# EAGLE design pr0board_main (EAGLE 9.6.2)
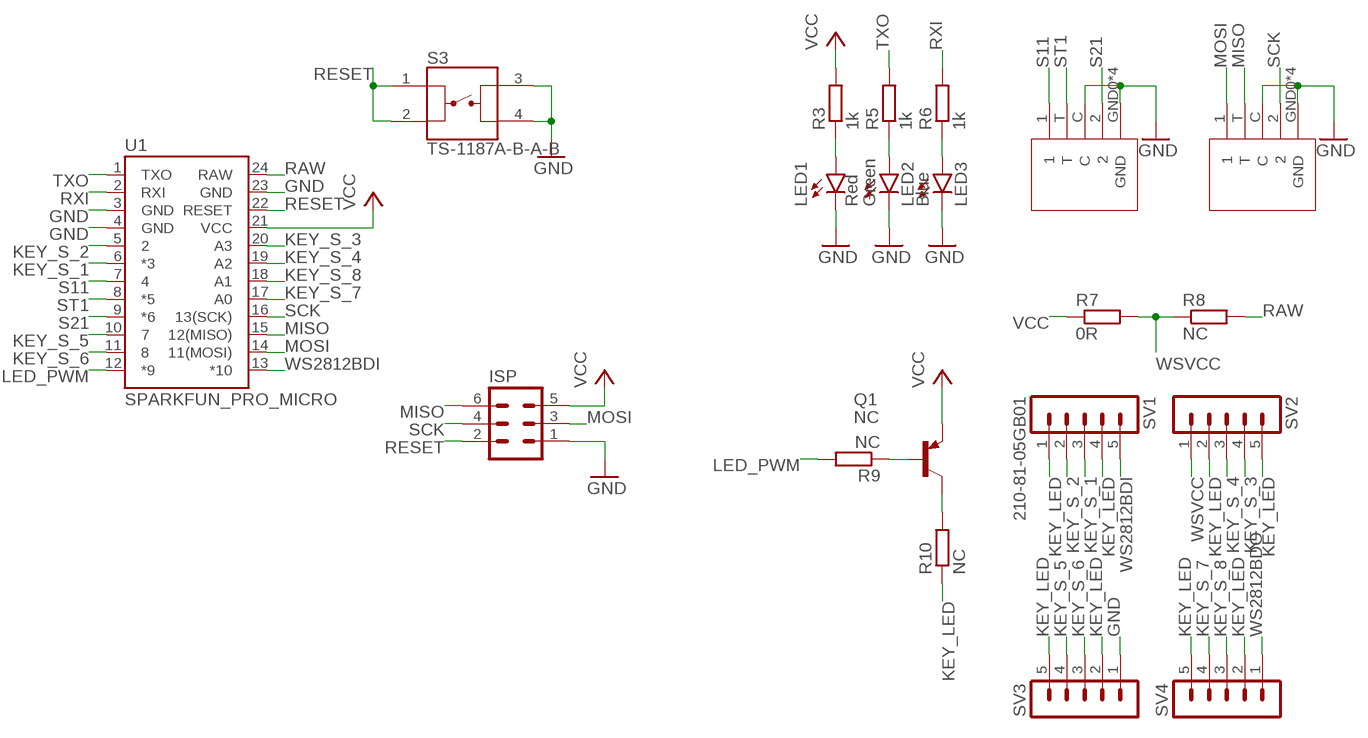
[diagram p0: schematic, sheet 1]

## Parts
ISP  MA03-2  [MA03-2]
LED1  Red  LEDCHIP-LED0603  [CHIP-LED0603]
LED2  Green  LEDCHIP-LED0603  [CHIP-LED0603]
LED3  Blue  LEDCHIP-LED0603  [CHIP-LED0603]
Q1  NC  MMBTA56-SOT23  [SOT23]
R3  1k  R-EU_R0603  [R0603]
R5  1k  R-EU_R0603  [R0603]
R6  1k  R-EU_R0603  [R0603]
R7  0R  R-EU_R0603  [R0603]
R8  NC  R-EU_R0603  [R0603]
R9  NC  R-EU_R0603  [R0603]
R10  NC  R-EU_R0805  [R0805]
S1  TM-2024A  [TM-2024A]
S2  TM-2024A  [TM-2024A]
S3  TS-1187A-B-A-B  PTS525SM15SMTR2LFS  [SW_PTS525SM15SMTR2LFS]
SV1  210-81-05GB01  MA05-1  [MA05-1]
SV2  MA05-1  [MA05-1]
SV3  MA05-1  [MA05-1]
SV4  MA05-1  [MA05-1]
U1  SPARKFUN_PRO_MICRO  [SPARKFUN_PRO_MICRO]

## Nets
GND: ISP.1 LED1.C LED2.C LED3.C S1.C S1.GND0(GND) S1.GND1(GND) S1.GND2(GND) S1.GND3(GND) S2.C S2.GND0(GND) S2.GND1(GND) S2.GND2(GND) S2.GND3(GND) S3.3 S3.4 SV3.1 U1.3(GND) U1.4(GND) U1.23(GND)
KEY_LED: R10.1 SV1.1 SV1.4 SV2.2 SV2.5 SV3.2 SV3.5 SV4.2 SV4.5
KEY_S_1: SV1.3 U1.6(*3)
KEY_S_2: SV1.2 U1.5
KEY_S_3: SV2.4 U1.20(A3)
KEY_S_4: SV2.3 U1.19(A2)
KEY_S_5: SV3.4 U1.10
KEY_S_6: SV3.3 U1.11
KEY_S_7: SV4.4 U1.17(A0)
KEY_S_8: SV4.3 U1.18(A1)
LED_PWM: R9.2 U1.12(*9)
MISO: ISP.6 S2.T U1.15(12(MISO))
MOSI: ISP.3 S2.1 U1.14(11(MOSI))
N$1: LED2.A R5.1
N$2: LED3.A R6.1
N$3: LED1.A R3.1
N$7: Q1.1(B) R9.1
N$11: Q1.3(C) R10.2
RAW: R8.2 U1.24(RAW)
RESET: ISP.2 S3.1 S3.2 U1.22(RESET)
RXI: R6.2 U1.2(RXI)
S11: S1.1 U1.7
S21: S1.2 U1.9(*6)
SCK: ISP.4 S2.2 U1.16(13(SCK))
ST1: S1.T U1.8(*5)
TXO: R5.2 U1.1(TXO)
VCC: ISP.5 Q1.2(E) R3.2 R7.1 U1.21(VCC)
WS2812BDI: SV1.5 U1.13(*10)
WS2812BDO: SV4.1
WSVCC: R7.2 R8.1 SV2.1

## Library data of the parts
ISP = con-lstb:MA03-2: PIN HEADER; OC_FARNELL: unknown; OC_NEWARK: unknown
LED1-LED3 = led:LED: LED OSRAM: - CHIPLED LG R971, LG N971, LY N971, LG Q971, LY Q971, LO R971, LY R971 LH N974, LH R974 LS Q976, LO Q976, LY Q976 LO Q996 - Hyper CHIPLED LW Q18S LB Q993, LB Q99A, LB R99A - SideLED LS A670, LO A670, LY A670, LG A670, LP A670 LB A673, LV A673, LT A673, LW A673 LH A674 LY A675 LS A676, LA A676, LO A676, LY A676, LW A676 LS A679, LY A679, LG A679 - Hyper Micro SIDELED® LS Y876, LA Y876, LO Y876, LY Y876 LT Y87S - SmartLED LW L88C, LW L88S LB L89C, LB L89S, LG L890 LS L89K, LO L89K, LY L89K LS L896, LA L896, LO L896, LY L896 - TOPLED LS T670, LO T670, LY T670, LG T670, LP T670 LSG T670, LSP T670, LSY T670, LOP T670, LYG T670 LG T671, LOG T671, LSG T671 LB T673, LV T673, LT T673, LW T673 LH T674 LS T676, LA T676, LO T676, LY T676, LB T676, LH T676, LSB T676, LW T676 LB T67C, LV T67C, LT T67C, LS T67K, LO T67K, LY T67K, LW E67C LS E67B, LA E67B, LO E67B, LY E67B, LB E67C, LV E67C, LT E67C LW T67C LS T679, LY T679, LG T679 LS T770, LO T770, LY T770, LG T770, LP T770 LB T773, LV T773, LT T773, LW T773 LH T774 LS E675, LA E675, LY E675, LS T675 LS T776, LA T776, LO T776, LY T776, LB T776 LHGB T686 LT T68C, LB T68C - Hyper Mini TOPLED® LB M676 - Mini TOPLED Santana® LG M470 LS M47K, LO M47K, LY M47K Source: http://www.osram.convergy.de LUXEON: - LUMILED® LXK2-PW12-R00, LXK2-PW12-S00, LXK2-PW14-U00, LXK2-PW14-V00 LXK2-PM12-R00, LXK2-PM12-S00, LXK2-PM14-U00 LXK2-PE12-Q00, LXK2-PE12-R00, LXK2-PE12-S00, LXK2-PE14-T00, LXK2-PE14-U00 LXK2-PB12-K00, LXK2-PB12-L00, LXK2-PB12-M00, LXK2-PB14-N00, LXK2-PB14-P00, LXK2-PB14-Q00 LXK2-PR12-L00, LXK2-PR12-M00, LXK2-PR14-Q00, LXK2-PR14-R00 LXK2-PD12-Q00, LXK2-PD12-R00, LXK2-PD12-S00 LXK2-PH12-R00, LXK2-PH12-S00 LXK2-PL12-P00, LXK2-PL12-Q00, LXK2-PL12-R00 Source: www.luxeon.com KINGBRIGHT: KA-3528ASYC Source: www.kingbright.com
Q1 = transistor-pnp:*-?: PNP Transistor
R3 R5-R8 = resistor:R-EU_: RESISTOR, European symbol
R9 R10 = rcl:R-EU_: RESISTOR, European symbol; SPICEPREFIX: R
S1 S2 = TM-2024A:TM-2024A
S3 = PTS525SM15SMTR2LFS:PTS525SM15SMTR2LFS: Switch Tactile N.O. SPST Round Button Gull Wing 0.02A 15VDC 1000000Cycles 1.569N SMD T/R Check prices <https://snapeda.com/parts/PTS525SM15SMTR2LFS/C%26K/view-part/?ref=eda>; AVAILABILITY: Warning; DESCRIPTION: Tactile Switch SPST-NO Top Actuated Surface Mount; MF: C&K; MOUSER-PURCHASE-URL: https://snapeda.com/shop?store=Mouser&id=756640; MP: PTS525SM15SMTR2LFS; PACKAGE: None; PRICE: None
SV1-SV4 = con-lstb:MA05-1: PIN HEADER; OC_FARNELL: unknown; OC_NEWARK: unknown
U1 = SparkFun-Boards:SPARKFUN_PRO_MICRO: SparkFun Pro Micro Atmega32U4 compatible footprint. SparkFun Products: 3.3V/8MHz <https://www.sparkfun.com/products/12587> 5V/16MHz <https://www.sparkfun.com/products/12640>

## Board
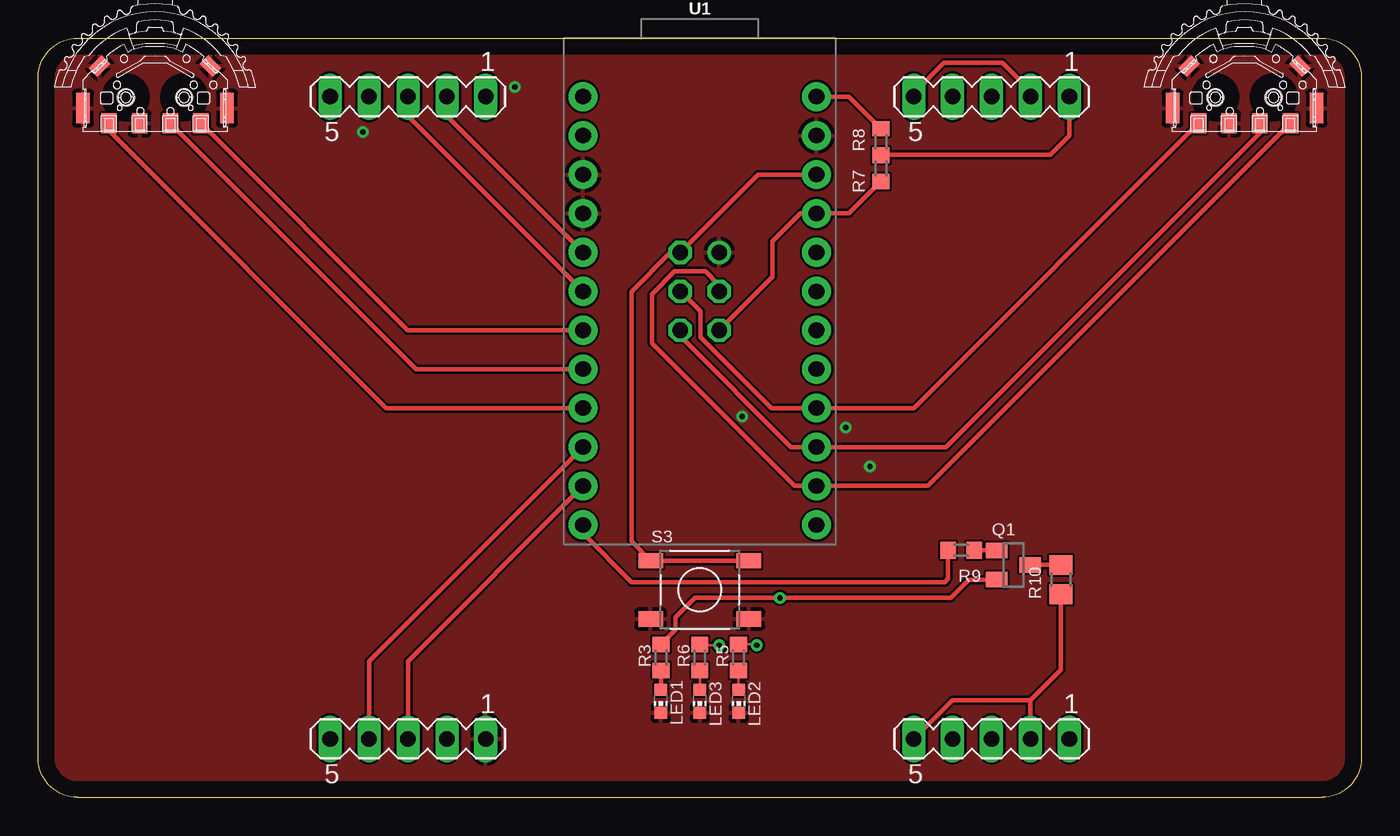
[diagram p1: board, top side]
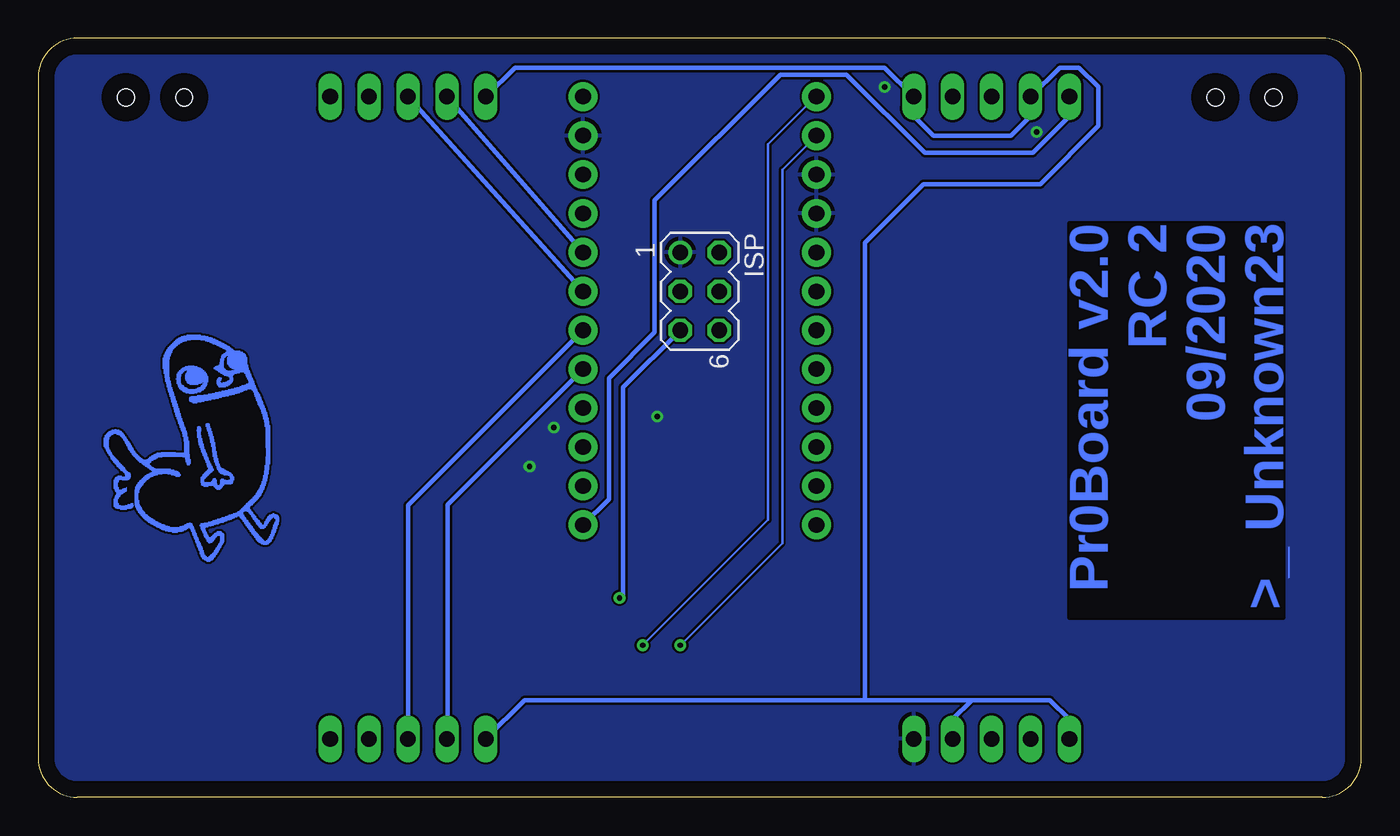
[diagram p2: board, bottom side, seen from below]

Size 86.36 x 49.53 mm. Coordinates in mm from the lower left corner, seen from the top.
Outline: 0,2.54 0,46.99 arc-90 2.54,49.53 83.82,49.53 arc-90 86.36,46.99 86.36,2.54 arc-90 83.82,0 2.54,0 arc-90 0,2.54
Copper layers (1*16): Top 0.035mm / dielectric 1.5mm / Bottom 0.035mm
Design rules "default": minimum track width 6mil, minimum drill 0.35mm, track to track 6mil, track to pad 6mil, pad to pad 6mil, via to via 6mil, smd to smd 6mil, copper to edge 40mil, drill to drill 6mil, minimum pad ring 10mil, minimum via ring 8mil, stop-mask expansion 4mil, vias tented up to drill 0mil, thermal gap 10mil

### Footprints (pad centres in the part's own frame; a part is rotated, then mirrored left to right if it is on the bottom)
MA03-2 = drill 1.016: 1 -2.54,-1.27 | drill 1.016 octagon: 2 -2.54,1.27; 3 0,-1.27; 4 0,1.27; 5 2.54,-1.27; 6 2.54,1.27
CHIP-LED0603 = smd 0.8 x 0.8: A 0,-0.75; C 0,0.75
SOT23 = smd 1 x 1.4: 1 -0.95,-1.1; 2 0.95,-1.1; 3 0,1.1
R0603 = smd 1 x 1.1: 1 -0.85,0; 2 0.85,0
R0805 = smd 1.3 x 1.5: 1 -0.95,0; 2 0.95,0
TM-2024A = smd 1 x 1.3: 1 3,-0.95; 2 -3,-0.95; C -1,-0.95; T 1,-0.95 | smd 0.9 x 2: GND0 -4.7,0.05; GND3 4.7,0.05 | smd 1.2 x 0.8 rotated 45: GND1 -3.62,2.8 | smd 1.2 x 0.8 rotated 315: GND2 3.62,2.8 | hole 1.1: -1.9,0.75; 1.9,0.75
SW_PTS525SM15SMTR2LFS = smd 1.6 x 1: 1 -3.2,1.9; 2 3.2,1.9; 3 -3.2,-1.9; 4 3.2,-1.9
MA05-1 = drill 1.016 long: 1 -5.08,0; 2 -2.54,0; 3 0,0; 4 2.54,0; 5 5.08,0
SPARKFUN_PRO_MICRO = drill 1.016 pad 1.88: 1 -7.62,12.7; 2 -7.62,10.16; 3 -7.62,7.62; 4 -7.62,5.08; 5 -7.62,2.54; 6 -7.62,0; 7 -7.62,-2.54; 8 -7.62,-5.08; 9 -7.62,-7.62; 10 -7.62,-10.16; 11 -7.62,-12.7; 12 -7.62,-15.24; 13 7.62,-15.24; 14 7.62,-12.7; 15 7.62,-10.16; 16 7.62,-7.62; 17 7.62,-5.08; 18 7.62,-2.54; 19 7.62,0; 20 7.62,2.54; 21 7.62,5.08; 22 7.62,7.62; 23 7.62,10.16; 24 7.62,12.7

### Placement (x,y rotation side)
ISP  43.18,33.02 270 bottom
LED1  40.64,6.27 180 top
LED2  45.72,6.27 180 top
LED3  43.18,6.27 180 top
Q1  63.66,15.16 270 top
R3  40.64,9.13 90 top
R5  45.72,9.13 90 top
R6  43.18,9.13 90 top
R7  55.01,41.04 90 top
R8  55.01,42.78 90 top
R9  60.25,16.11 180 top
R10  66.75,14.21 90 top
S1  7.62,44.93 0 top
S2  78.74,44.93 0 top
S3  43.18,13.54 0 top
SV1  24.13,45.72 180 top
SV2  62.23,45.72 180 top
SV3  24.13,3.81 180 top
SV4  62.23,3.81 180 top
U1  43.18,33.02 0 top

### Tracks (layer width: path | path; a pad name or v marks a point on that pad's centre or on a via)
GND  (via drill 0.35)
  other vias: 52.7,24.13 21.19,43.42 31.11,46.35 45.96,24.84 54.29,21.59
  pour Bottom: -0.16,-0.87 -0.16,50.8 86.68,50.8 86.68,-0.87
  pour Top: -0.32,-1.03 -0.32,49.85 86.92,49.85 86.92,-1.03
KEY_LED
  Top 0.305: R10.1 66.75,8.33 64.77,6.35 | SV2.2 64.77,46.12 62.94,47.94 59.13,47.94 57.15,45.96 SV2.5 | SV4.5 59.69,6.35 64.77,6.35 | SV4.2 64.77,6.35
  Bottom 0.305: SV3.5 19.05,5.08 20.32,6.35 25.4,6.35 | 25.4,6.35 26.67,5.08 SV3.2 | 25.4,6.35 32.38,6.35 | 32.38,6.35 32.38,36.2 28.57,40.01 20.95,40.01 17.14,43.81 17.14,46.35 18.41,47.62 19.68,47.62 SV1.4 21.59,44.45 22.86,43.18 27.94,43.18 29.21,44.45 SV1.1 31.11,47.62 55.24,47.62 SV2.5 | 32.38,6.35 54.61,6.35 SV4.5
KEY_S_1
  Top 0.305: SV1.3 24.13,44.45 U1.6
KEY_S_2
  Top 0.305: SV1.2 26.67,44.45 U1.5
KEY_S_3
  Bottom 0.305: U1.20 SV2.4
KEY_S_4
  Bottom 0.305: U1.19 SV2.3
KEY_S_5
  Top 0.305: SV3.4 21.59,8.89 U1.10
KEY_S_6
  Top 0.305: U1.11 24.13,8.89 SV3.3
KEY_S_7
  Bottom 0.305: U1.17 59.65,19.09 59.65,3.85 SV4.4
KEY_S_8
  Bottom 0.305: U1.18 61.99,19.29 62.23,19.05 SV4.3
LED_PWM
  Top 0.305: R9.2 59.4,14.26 59.18,14.05 38.73,14.05 35.56,17.22 U1.12
MISO
  Top 0.305: ISP.6 41.91,30.07 49.12,22.86 U1.15 59.26,22.86 79.74,43.34 S2.T
MOSI
  Top 0.305: ISP.3 44.45,33.42 43.54,34.33 41.55,34.33 40.05,32.83 40.05,29.64 49.37,20.32 U1.14 58.08,20.32 S2.1
N$1
  Top 0.152: R5.1 LED2.A
N$2
  Top 0.152: R6.1 LED3.A
N$3
  Top 0.305: LED1.A R3.1
N$7
  Top 0.305: R9.1 Q1.1
N$11
  Top 0.305: Q1.3 R10.2
RAW
  Top 0.305: U1.24 52.92,45.72 R8.2
RESET
  Top 0.305: U1.22 46.99,40.64 ISP.2 41.27,35.56 38.71,32.99 38.71,16.71 S3.1 S3.2
RXI  (via drill 0.35)
  Top 0.152: R6.2 43.24,9.92 v44.45,9.92
  Bottom 0.152: v44.45,9.92 37.78,16.59 37.78,40.96 U1.2
S11
  Top 0.305: S1.1 24.12,30.48 U1.7
S21
  Top 0.305: S1.2 4.62,43.5 22.72,25.4 U1.9
SCK
  Top 0.305: ISP.4 43.22,31.71 43.22,30.04 47.86,25.4 U1.16 57.16,25.4 S2.2
ST1
  Top 0.305: S1.T 24.66,27.94 U1.8
TXO  (via drill 0.35)
  Top 0.152: v46.91,9.92 46.85,9.98 R5.2
  Bottom 0.152: U1.1 35.62,45.72 38.72,42.62 38.72,18.11 v46.91,9.92
VCC  (via drill 0.35)
  Top 0.305: ISP.5 47.94,33.97 47.94,36.27 49.77,38.1 U1.21 52.92,38.1 R7.1 | Q1.2 60.77,14.21 59.57,13.02 v48.42,13.02 42.86,13.02 41.59,11.75 41.59,10.93 R3.2
  Bottom 0.305: v48.42,13.02 48.18,13.26 48.18,26.75 ISP.5
WS2812BDI
  Bottom 0.305: U1.13 49.11,19.47 49.11,27.34 46.12,30.33 46.12,38.97 37.92,47.17 33.59,47.17 28.5,42.07 21.43,42.07 19.05,44.45 SV1.5
WSVCC
  Top 0.305: R7.2 R8.1 66.06,41.93 67.31,43.18 SV2.1
(copper drawn outside any net)
  shapes: Bottom area x1184

### Text on the board
Bottom: Pr0Board v2.0 / RC 2 / 09/2020 / >_ Unknown23
bStop: Pr0Board v2.0 / RC 2 / 09/2020 / >_ Unknown23